# Altium schematic sheet CAN.SchDoc
size A4
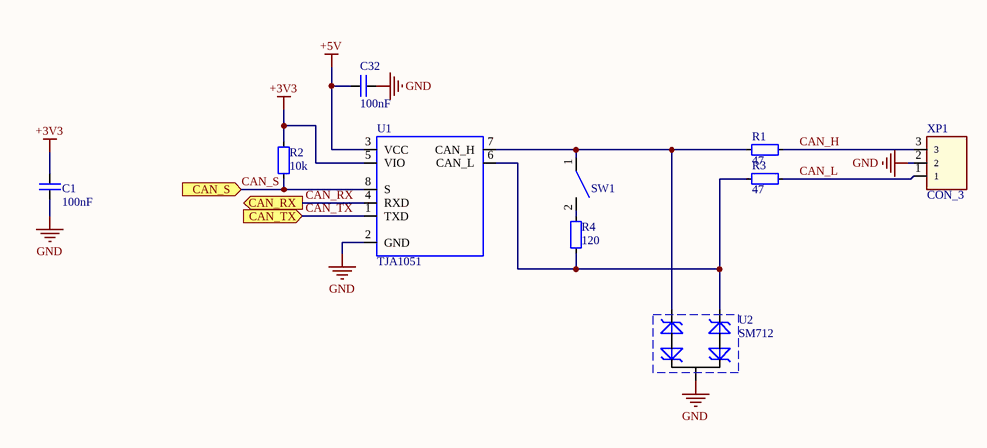
[diagram p0: CAN.SchDoc]

## Parts
C1  100nF  [SMD_0805]
C32  100nF  [SMD_0805]
R1  47  [SMD_0805]
R2  10k  [SMD_0805]
R3  47  [SMD_0805]
R4  120  [SMD_0805]
SW1  SW_DIP/2.54  [DIP-SW/2.54/1]  (value not drawn)
U1  TJA1051  [SO8-150mil]
U2  SM712  [SOT23-3]
XP1  CON_3  [MW-3M-2.0]

## Ports
CAN_RX (out), CAN_S (in), CAN_TX (in)

## Nets
+3V3: C1.1 R2.2 U1.5(VIO)
+5V: C32.1 U1.3(VCC)
GND: C1.2 C32.2 U1.2(GND) U2.3 XP1.2
CAN_H: R1.1 XP1.3
CAN_L: R3.1 XP1.1
CAN_RX: U1.4(RXD) ; port CAN_RX
CAN_S: R2.1 U1.8(S) ; port CAN_S
CAN_TX: U1.1(TXD) ; port CAN_TX
NetR1_2: R1.2 SW1.1 U1.7(CAN_H) U2.1
NetR3_2: R3.2 R4.1 U1.6(CAN_L) U2.2
NetR4_2: R4.2 SW1.2

Not connected (* = marked no-connect by the designer): SW1 3 4

## Library data of the parts
C1 C32 = C_NONE_POLAR: None polar capacitor; Value: 100nF
  C32: Case: 0805
R1-R4 = RES: Resistor
  R1 R3: Value: 47; Case: 0805
  R2: Value: 10k
  R4: Value: 120
SW1 = SW: Switch
U2 = SM712: TVS diodes